# EAGLE design stoneAssistant_pwrMgmt (EAGLE 9.0.0)
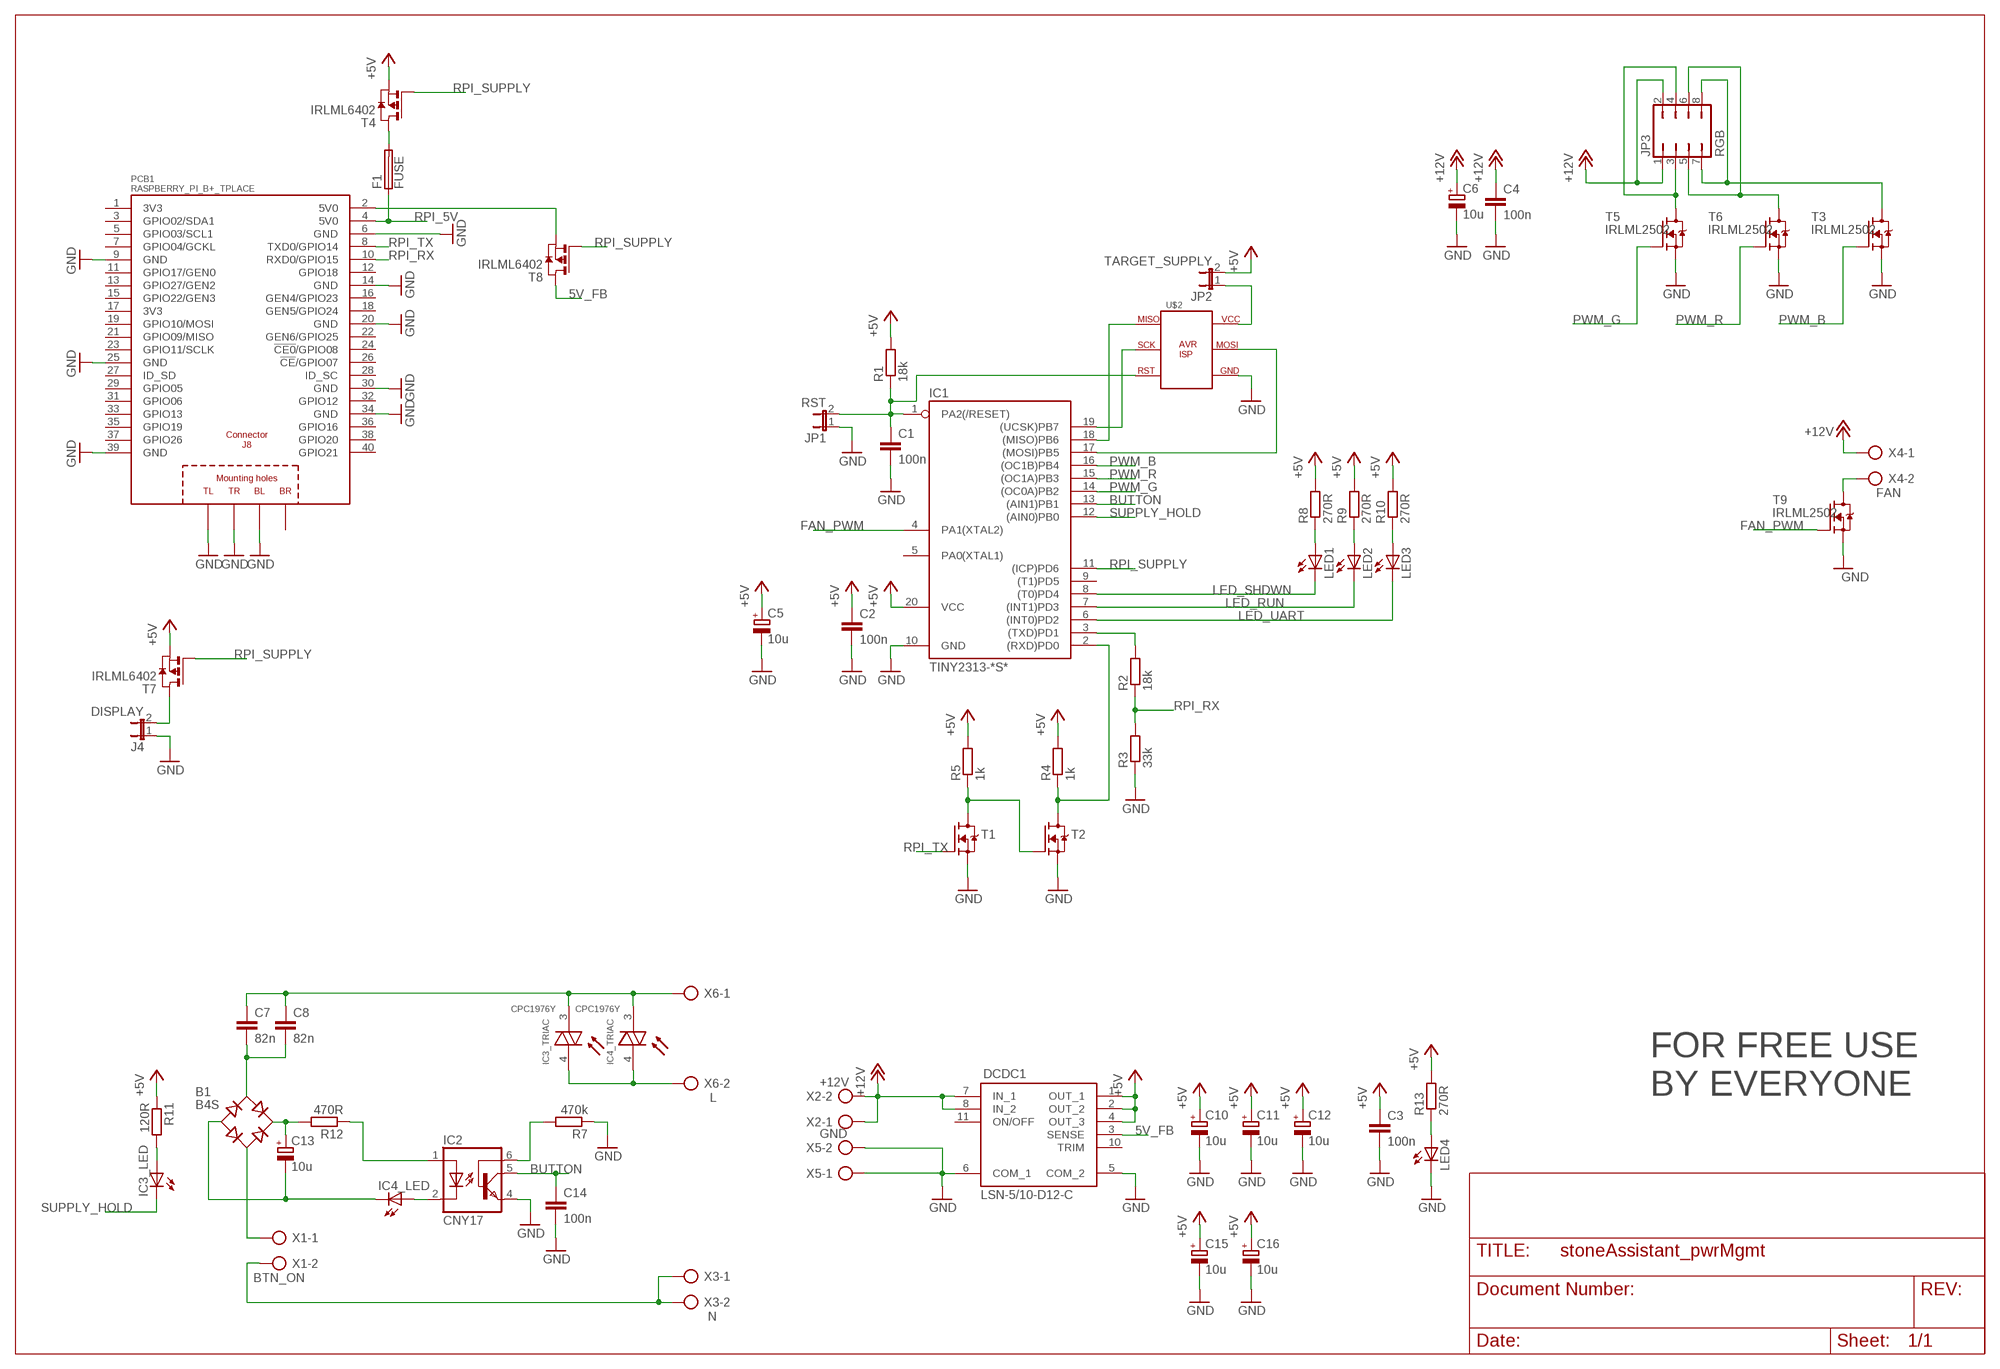
[diagram p0: schematic, sheet 1]

## Parts
B1  B4S  [MBS]
C1  100n  C-EUC0805  [C0805]
C2  100n  C-EUC0805  [C0805]
C3  100n  C-EUC0805  [C0805]
C4  100n  C-EUC0805  [C0805]
C5  10u  CPOL-EUSMCA  [SMC_A]
C6  10u  CPOL-EUSMCA  [SMC_A]
C7  82n  C-EU050-075X075  [C050-075X075]
C8  82n  C-EU050-075X075  [C050-075X075]
C10  10u  CPOL-EUSMCA  [SMC_A]
C11  10u  CPOL-EUSMCA  [SMC_A]
C12  10u  CPOL-EUSMCA  [SMC_A]
C13  10u  CPOL-EUSMCA  [SMC_A]
C14  100n  C-EUC0805  [C0805]
C15  10u  CPOL-EUSMCA  [SMC_A]
C16  10u  CPOL-EUSMCA  [SMC_A]
DCDC1  LSN-5/10-D12-C  [MURATA_LSN-5/10-D12-C]
F1  FUSE  MF-SMDF200  [MF-SMDF050]
IC1  TINY2313-*S*  [SO20L$]
IC2  CNY17  [DIL06]
IC3  CPC1976Y  [SIP8/4]
IC4  CPC1976Y  [SIP8/4]
J4  DISPLAY  JP1E  [JP1]
JP1  RST  JP1E  [JP1]
JP2  TARGET_SUPPLY  JP1E  [JP1]
JP3  RGB  JP4Q  [JP4Q]
LED1  LEDCHIPLED_0805  [CHIPLED_0805]
LED2  LEDCHIPLED_0805  [CHIPLED_0805]
LED3  LEDCHIPLED_0805  [CHIPLED_0805]
LED4  LEDCHIPLED_0805  [CHIPLED_0805]
PCB1  RASPBERRY_PI_B+_TPLACE  [RASPBERRY_PI_BPLUS_TPLACE]
R1  18k  R-EU_M0805  [M0805]
R2  18k  R-EU_M0805  [M0805]
R3  33k  R-EU_M0805  [M0805]
R4  1k  R-EU_M0805  [M0805]
R5  1k  R-EU_M0805  [M0805]
R7  470k  R-EU_M0805  [M0805]
R8  270R  R-EU_M0805  [M0805]
R9  270R  R-EU_M0805  [M0805]
R10  270R  R-EU_M0805  [M0805]
R11  120R  R-EU_M0805  [M0805]
R12  470R  R-EU_M0805  [M0805]
R13  270R  R-EU_M0805  [M0805]
T1  MOSFET-N-SOT23  [SOT23]
T2  MOSFET-N-SOT23  [SOT23]
T3  IRLML2502  [SOT-23]
T4  IRLML6402  [SOT-23]
T5  IRLML2502  [SOT-23]
T6  IRLML2502  [SOT-23]
T7  IRLML6402  [SOT-23]
T8  IRLML6402  [SOT-23]
T9  IRLML2502  [SOT-23]
U$2  AVR_ISPSINGLESIDED_SMD  [PINHEADER_254_2X3_SMD]
X1  BTN_ON  PCB2_TERMINAL-BLOCK  [2_2.54MM]
X2  +12V  PCB2_TERMINAL-BLOCK  [2_2.54MM]
X3  N  PCB2_TERMINAL-BLOCK  [2_2.54MM]
X4  FAN  PCB2_TERMINAL-BLOCK  [2_2.54MM]
X5  GND  PCB2_TERMINAL-BLOCK  [2_2.54MM]
X6  L  PCB2_TERMINAL-BLOCK  [2_2.54MM]

## Nets
5V_FB: DCDC1.3(SENSE) T8.3(D)
+5V: C2.1 C3.1 C5.+ C10.+ C11.+ C12.+ C15.+ C16.+ DCDC1.1(OUT_1) DCDC1.2(OUT_2) DCDC1.4(OUT_3) IC1.20(VCC) JP2.2 R1.2 R4.2 R5.2 R8.2 R9.2 R10.2 R11.1 R13.2 T4.2(S) T7.2(S)
+12V: C4.1 C6.+ DCDC1.7(IN_1) DCDC1.8(IN_2) JP3.1 JP3.2 X2.1 X2.2 X4.1
BUTTON: C14.1 IC1.13((AIN1)PB1) IC2.5(COL)
FAN_PWM: IC1.4(PA1(XTAL2)) T9.1(G)
GND: C1.2 C2.2 C3.2 C4.2 C5.- C6.- C10.- C11.- C12.- C14.2 C15.- C16.- DCDC1.5(COM_2) DCDC1.6(COM_1) IC1.10(GND) IC2.4(EMI) J4.1 JP1.1 LED4.C PCB1.6(GND) PCB1.9(GND) PCB1.14(GND) PCB1.20(GND) PCB1.25(GND) PCB1.30(GND) PCB1.34(GND) PCB1.39(GND) PCB1.PE_BL(BL) PCB1.PE_TL(TL) PCB1.PE_TR(TR) R3.1 R7.1 T1.2(S) T2.2(S) T3.2(S) T5.2(S) T6.2(S) T9.2(S) U$2.P$6(GND) X5.1 X5.2
LED_RUN: IC1.7((INT1)PD3) LED2.C
LED_SHDWN: IC1.8((T0)PD4) LED1.C
LED_UART: IC1.6((INT0)PD2) LED3.C
N$1: C1.1 IC1.1(PA2(/RESET)) JP1.2 R1.1 U$2.P$3(RST)
N$2: IC1.3((TXD)PD1) R2.2
N$3: IC1.2((RXD)PD0) R4.1 T2.3(D)
N$4: R5.1 T1.3(D) T2.1(G)
N$5: IC2.2(C) IC4.2(_LED:A)
N$6: IC1.19((UCSK)PB7) U$2.P$2(SCK)
N$7: IC1.18((MISO)PB6) U$2.P$1(MISO)
N$8: IC1.17((MOSI)PB5) U$2.P$7(MOSI)
N$9: JP2.1 U$2.P$8(VCC)
N$10: IC3.4(_TRIAC:A/C2) IC4.4(_TRIAC:A/C2) X6.2
N$11: C7.1 C8.1 IC3.3(_TRIAC:A/C1) IC4.3(_TRIAC:A/C1) X6.1
N$12: X1.2 X3.1 X3.2
N$13: B1.AC1 C7.2 C8.2
N$14: B1.- C13.- IC4.1(_LED:C)
N$15: B1.+ C13.+ R12.2
N$16: B1.AC2 X1.1
N$17: IC2.1(A) R12.1
N$18: IC2.6(BAS) R7.2
N$19: F1.2 T4.3(D)
N$20: LED4.A R13.1
N$21: JP3.3 JP3.4 T5.3(D)
N$22: JP3.5 JP3.6 T6.3(D)
N$23: JP3.7 JP3.8 T3.3(D)
N$24: J4.2 T7.3(D)
N$25: T9.3(D) X4.2
N$31: IC3.2(_LED:A) R11.2
N$32: PCB1.2(5V0) T8.2(S)
N$34: LED1.A R8.1
N$35: LED2.A R9.1
N$36: LED3.A R10.1
PWM_B: IC1.16((OC1B)PB4) T3.1(G)
PWM_G: IC1.14((OC0A)PB2) T5.1(G)
PWM_R: IC1.15((OC1A)PB3) T6.1(G)
RPI_5V: F1.1 PCB1.4(5V0)
RPI_RX: PCB1.10(RXD0/GPIO15) R2.1 R3.2
RPI_SUPPLY: IC1.11((ICP)PD6) T4.1(G) T7.1(G) T8.1(G)
RPI_TX: PCB1.8(TXD0/GPIO14) T1.1(G)
SUPPLY_HOLD: IC1.12((AIN0)PB0) IC3.1(_LED:C)
Unconnected: DCDC1.10(TRIM) DCDC1.11(ON/OFF) IC1.5(PA0(XTAL1)) IC1.9((T1)PD5) PCB1.3(GPIO02/SDA1) PCB1.5(GPIO03/SCL1) PCB1.7(GPIO04/GCKL) PCB1.11(GPIO17/GEN0) PCB1.12(GPIO18) PCB1.13(GPIO27/GEN2) PCB1.15(GPIO22/GEN3) PCB1.16(GEN4/GPIO23) PCB1.18(GEN5/GPIO24) PCB1.19(GPIO10/MOSI) PCB1.21(GPIO09/MISO) PCB1.22(GEN6/GPIO25) PCB1.23(GPIO11/SCLK) PCB1.24(!CE0!/GPIO08) PCB1.26(!CE!/GPIO07) PCB1.27(ID_SD) PCB1.28(ID_SC) PCB1.29(GPIO05) PCB1.31(GPIO06) PCB1.32(GPIO12) PCB1.33(GPIO13) PCB1.35(GPIO19) PCB1.36(GPIO16) PCB1.37(GPIO26) PCB1.38(GPIO20) PCB1.40(GPIO21) PCB1.PE_BR(BR)

## Notes on the sheet
- FOR FREE USE
  BY EVERYONE

## Power pins joined to a net without a drawn wire
3V3: PCB1.1(3V3) PCB1.17(3V3)

## Library data of the parts
B1 = rectifier:B*S: Surface Mount Glass Passivated Bridge Rectifiers Source: Comchip Bridge Rectifiers B05S-G_B10S-G.pdf
C1-C4 C7 C8 C14 = rcl:C-EU: CAPACITOR, European symbol
C5 C6 C10-C13 C15 C16 = rcl:CPOL-EU: POLARIZED CAPACITOR, European symbol
DCDC1 = DCDC:LSN-5/10-D12-C
F1 = fuse:MF-SMDF: MF-SMDF Series - PRC Resettable Fuses Source: http://www.farnell.com/datasheets/716597.pdf
IC1 = avr-7:TINY2313*: Atmel Tiny2313 2K Flash, 128 bytes EEPROM, 128 bytes RAM
IC2 = optocoupler:CNY17: SIEMENS OPTO COUPLER; MPN: CNY17-1; OC_FARNELL: 1045399; OC_NEWARK: 05M4044
IC3 IC4 = optotriac:CPC1976Y
J4 JP1 JP2 = jumper:JP1E: JUMPER
JP3 = jumper:JP4Q: JUMPER
LED1-LED4 = led:LED: LED OSRAM: - CHIPLED LG R971, LG N971, LY N971, LG Q971, LY Q971, LO R971, LY R971 LH N974, LH R974 LS Q976, LO Q976, LY Q976 LO Q996 - Hyper CHIPLED LW Q18S LB Q993, LB Q99A, LB R99A - SideLED LS A670, LO A670, LY A670, LG A670, LP A670 LB A673, LV A673, LT A673, LW A673 LH A674 LY A675 LS A676, LA A676, LO A676, LY A676, LW A676 LS A679, LY A679, LG A679 - Hyper Micro SIDELED® LS Y876, LA Y876, LO Y876, LY Y876 LT Y87S - SmartLED LW L88C, LW L88S LB L89C, LB L89S, LG L890 LS L89K, LO L89K, LY L89K LS L896, LA L896, LO L896, LY L896 - TOPLED LS T670, LO T670, LY T670, LG T670, LP T670 LSG T670, LSP T670, LSY T670, LOP T670, LYG T670 LG T671, LOG T671, LSG T671 LB T673, LV T673, LT T673, LW T673 LH T674 LS T676, LA T676, LO T676, LY T676, LB T676, LH T676, LSB T676, LW T676 LB T67C, LV T67C, LT T67C, LS T67K, LO T67K, LY T67K, LW E67C LS E67B, LA E67B, LO E67B, LY E67B, LB E67C, LV E67C, LT E67C LW T67C LS T679, LY T679, LG T679 LS T770, LO T770, LY T770, LG T770, LP T770 LB T773, LV T773, LT T773, LW T773 LH T774 LS E675, LA E675, LY E675, LS T675 LS T776, LA T776, LO T776, LY T776, LB T776 LHGB T686 LT T68C, LB T68C - Hyper Mini TOPLED® LB M676 - Mini TOPLED Santana® LG M470 LS M47K, LO M47K, LY M47K Source: http://www.osram.convergy.de LUXEON: - LUMILED® LXK2-PW12-R00, LXK2-PW12-S00, LXK2-PW14-U00, LXK2-PW14-V00 LXK2-PM12-R00, LXK2-PM12-S00, LXK2-PM14-U00 LXK2-PE12-Q00, LXK2-PE12-R00, LXK2-PE12-S00, LXK2-PE14-T00, LXK2-PE14-U00 LXK2-PB12-K00, LXK2-PB12-L00, LXK2-PB12-M00, LXK2-PB14-N00, LXK2-PB14-P00, LXK2-PB14-Q00 LXK2-PR12-L00, LXK2-PR12-M00, LXK2-PR14-Q00, LXK2-PR14-R00 LXK2-PD12-Q00, LXK2-PD12-R00, LXK2-PD12-S00 LXK2-PH12-R00, LXK2-PH12-S00 LXK2-PL12-P00, LXK2-PL12-Q00, LXK2-PL12-R00 Source: www.luxeon.com KINGBRIGHT: KA-3528ASYC Source: www.kingbright.com
PCB1 = RASPBERRY_PI_Bplus:RASPBERRY_PI_B+: Raspberry Pi B+ Basedon issue: Thursday, July 10, 2014 - Rev 1.2 LBR by Tim Rettmann 07-2014
R1-R5 R7-R13 = rcl:R-EU_: RESISTOR, European symbol
T1 T2 = we-transistor:MOSFET-N: N-Channel MOSFET SOT23 N-Chn MOSFET TSM3404, IRLML2502 (Vgs>=+/-20V, Vds<=20V, Id>=3A + Rds<=0.05Ohm @ Vgs=4.5V) BSS138 (Vgs>=+/-20V, Vds<=40V, Id>=0.2A + Rds<=3Ohm @ Vgs=4.5V) SOT223 Low Side Switch with Protection (Infineon) BSP76 (Vin=0...10V, Vds<=42V, Id=1.4A + Rds=0.2Ohm @ Vin=5V) BSP77 (Vin=0...10V, Vds<=42V, Id=2.2A + Rds=0.1Ohm @ Vin=5V) D²Pak Low Side Switch with Protection (Infineon) BTS117TC (Vin=0...10V, Vds<=60V, Id=3.5A + Rds=0.12Ohm @ Vin=5V) BTS133TC (Vin=0...10V, Vds<=60V, Id=7A + Rds=0.06Ohm @ Vin=5V) BTS141TC (Vin=0...10V, Vds<=60V, Id=12A + Rds=0.03Ohm @ Vin=5V) BTS3018TC (Vin=0...10V, Vds<=60V, Id=6A + Rds=0.02Ohm @ Vin=5V)
T3 T5 T6 T9 = nxs_transistor:IRLML2502: N-Channel MOSFET, Ultra Low On-Resistance, Logic Level www.irf.com
T4 T7 T8 = IRLML6402:IRLML6402
U$2 = stoneTronics:AVR_ISP
X1-X6 = nxs_con-misc:PCB2_TERMINAL-BLOCK: 2 way PCB terminal block 2.54mm RS Best.-Nr.: 790-1098

## Board
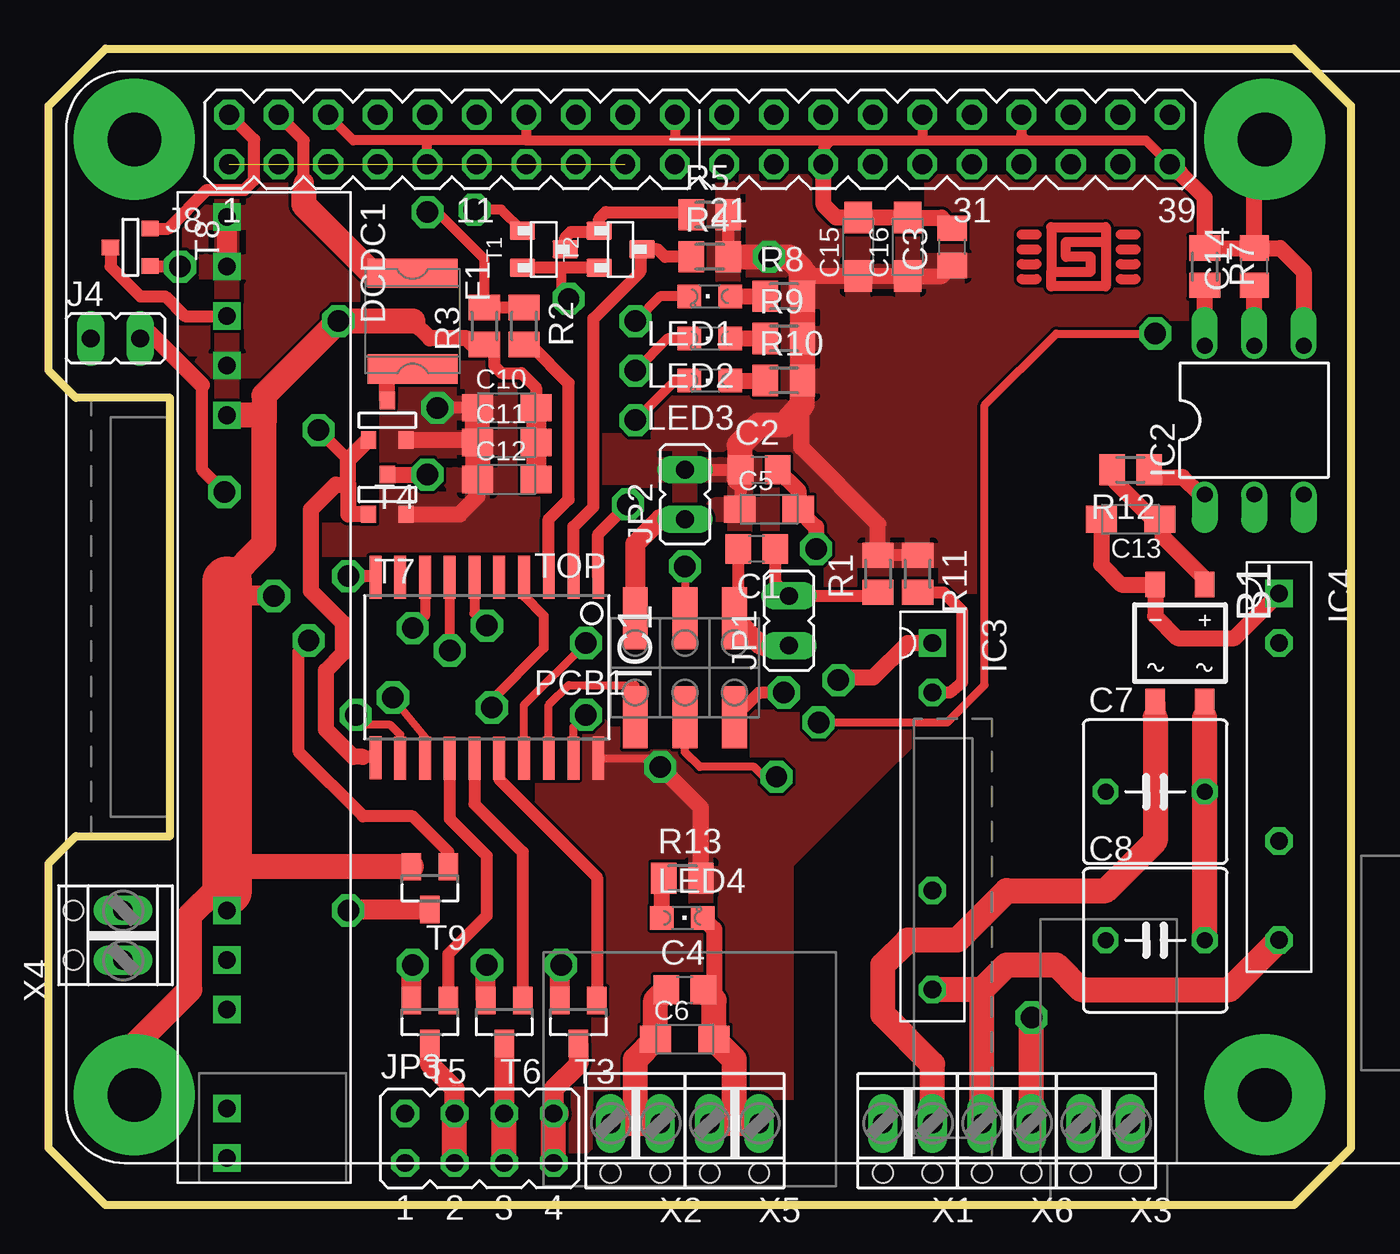
[diagram p1: board, top side]
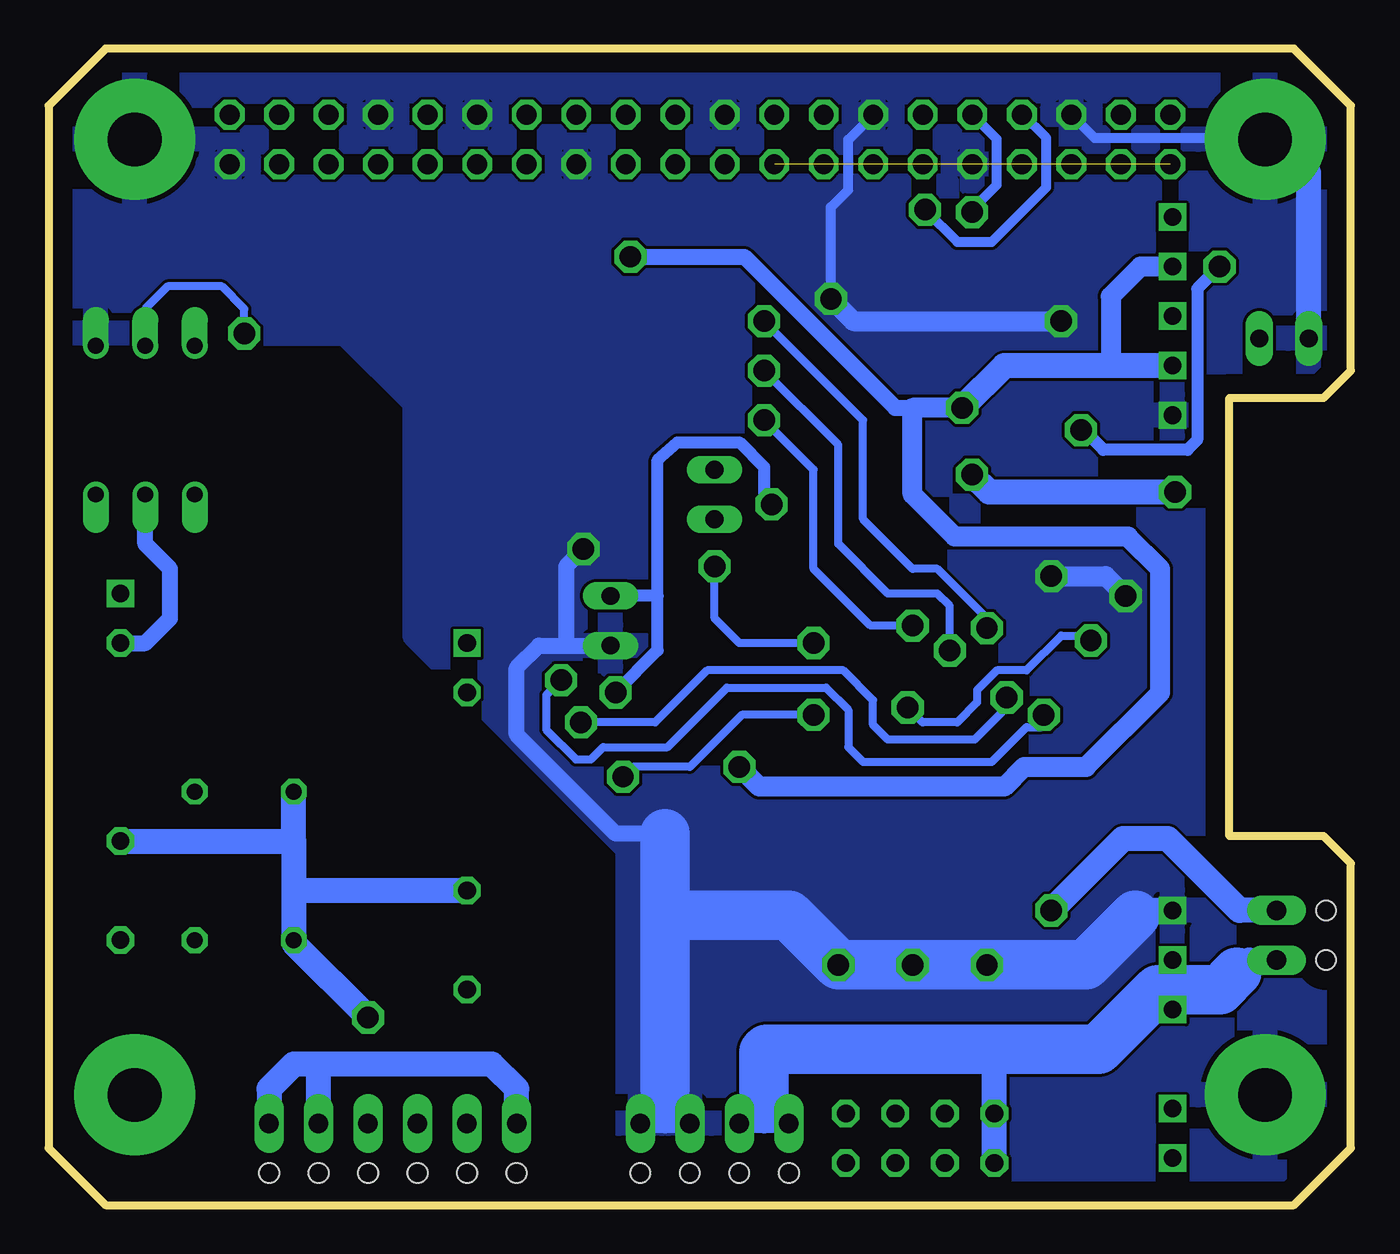
[diagram p2: board, bottom side, seen from below]

Size 66.8 x 59.31 mm. Coordinates in mm from the lower left corner, seen from the top.
Outline: 2.92,0 0,2.92 0,17.53 1.4,18.92 6.22,18.92 6.22,41.4 1.4,41.4 0,42.8 0,56.39 2.92,59.31 63.88,59.31 66.8,56.39 66.8,2.92 63.88,0 2.92,0
Copper layers (1*16): Top 0.035mm / dielectric 1.5mm / Bottom 0.035mm
Design rules "default": minimum track width 6mil, minimum drill 0.35mm, track to track 6mil, track to pad 6mil, pad to pad 6mil, via to via 6mil, smd to smd 6mil, copper to edge 40mil, drill to drill 6mil, minimum pad ring 10mil, minimum via ring 8mil, stop-mask expansion 4mil, vias tented up to drill 0mil, thermal gap 10mil

### Footprints (pad centres in the part's own frame; a part is rotated, then mirrored left to right if it is on the bottom)
MBS = smd 1 x 1.3: + -1.27,-3; - 1.27,-3; AC1 -1.27,3; AC2 1.27,3
C0805 = smd 1.3 x 1.5: 1 -0.95,0; 2 0.95,0
SMC_A = smd 1.6 x 1.4: + -1.5,0; - 1.5,0
C050-075X075 = drill 0.813 octagon: 1 -2.54,0; 2 2.54,0
MURATA_LSN-5/10-D12-C = drill 0.9 square: 1 -25.4,-1.27; 2 -22.86,-1.27; 3 -20.32,-1.27; 4 -17.78,-1.27; 5 -15.24,-1.27; 6 10.16,-1.27; 7 12.7,-1.27; 8 15.24,-1.27; 10 20.32,-1.27; 11 22.86,-1.27
MF-SMDF050 = smd 1.5 x 4.6: 1 -2.45,0; 2 2.45,0
SO20L$ = smd 0.61 x 2.21: 1 -5.715,-4.636; 2 -4.445,-4.636; 3 -3.175,-4.636; 4 -1.905,-4.636; 5 -0.635,-4.636; 6 0.635,-4.636; 7 1.905,-4.636; 8 3.175,-4.636; 9 4.445,-4.636; 10 5.715,-4.636; 11 5.715,4.61; 12 4.445,4.636; 13 3.175,4.636; 14 1.905,4.636; 15 0.635,4.636; 16 -0.635,4.636; 17 -1.905,4.636; 18 -3.175,4.636; 19 -4.445,4.636; 20 -5.715,4.636
DIL06 = drill 0.813 offset: 1 -2.54,-3.81; 2 0,-3.81; 3 2.54,-3.81; 4 2.54,3.81; 5 0,3.81; 6 -2.54,3.81
SIP8/4 = drill 0.9 square: 1 -8.89,0 | drill 0.9 octagon: 2 -6.35,0; 3 3.81,0; 4 8.89,0
JP1 = drill 0.914 long: 1 0,-1.27; 2 0,1.27
JP4Q = drill 0.914 octagon: 1 -3.81,-1.27; 2 -3.81,1.27; 3 -1.27,-1.27; 4 -1.27,1.27; 5 1.27,-1.27; 6 1.27,1.27; 7 3.81,-1.27; 8 3.81,1.27
CHIPLED_0805 = smd 1.2 x 1.2: A 0,-1.05; C 0,1.05
RASPBERRY_PI_BPLUS_TPLACE = drill 1.016 octagon: 1 8.37,51.23; 2 8.37,53.77; 3 10.91,51.23; 4 10.91,53.77; 5 13.45,51.23; 6 13.45,53.77; 7 15.99,51.23; 8 15.99,53.77; 9 18.53,51.23; 10 18.53,53.77; 11 21.07,51.23; 12 21.07,53.77; 13 23.61,51.23; 14 23.61,53.77; 15 26.15,51.23; 16 26.15,53.77; 17 28.69,51.23; 18 28.69,53.77; 19 31.23,51.23; 20 31.23,53.77; 21 33.77,51.23; 22 33.77,53.77; 23 36.31,51.23; 24 36.31,53.77; 25 38.85,51.23; 26 38.85,53.77; 27 41.39,51.23; 28 41.39,53.77; 29 43.93,51.23; 30 43.93,53.77; 31 46.47,51.23; 32 46.47,53.77; 33 49.01,51.23; 34 49.01,53.77; 35 51.55,51.23; 36 51.55,53.77; 37 54.09,51.23; 38 54.09,53.77; 39 56.63,51.23; 40 56.63,53.77 | drill 2.75 pad 6.2: PE_BL 3.5,3.5; PE_BR 61.5,3.5; PE_TL 3.5,52.5; PE_TR 61.5,52.5
M0805 = smd 1.3 x 1.6: 1 -0.95,0; 2 0.95,0
SOT23 = smd 1.3 x 0.9: 1 -1.1,0.95; 2 -1.1,-0.95; 3 1.1,0
SOT-23 = smd 1 x 1.4: 1 -0.95,-1.1; 2 0.95,-1.1; 3 0,1.1
SOT-23' = smd 0.787 x 0.889: 1 0.991,1.016; 2 -0.94,1.016; 3 0.025,-1.016
PINHEADER_254_2X3_SMD = smd 1.27 x 3.175: P$1 -3.81,-1.27; P$2 -1.27,-1.27; P$3 1.27,-1.27; P$6 1.27,3.81; P$7 -1.27,3.81; P$8 -3.81,3.81
2_2.54MM = drill 1 long: 1 -1.27,0; 2 1.27,0 | hole 1.016: 1.27,2.54; -1.27,2.54

### Placement (x,y rotation side)
B1  58.04,28.83 180 top
C1  36.32,33.66 180 top
C2  36.45,37.72 0 top
C3  46.36,49.15 90 top
C4  32.64,11.05 0 top
C5  36.96,35.69 0 top
C6  32.64,8.51 0 top
C7  56.77,21.21 0 top
C8  56.77,13.59 0 top
C10  23.5,40.89 0 top
C11  23.5,39.12 0 top
C12  23.5,37.21 0 top
C13  55.5,35.18 180 top
C14  61.85,48.13 90 top
C15  41.53,49.15 90 top
C16  44.07,49.15 90 top
DCDC1  10.41,25.27 270 top
F1  18.67,45.34 270 top
IC1  22.48,27.56 180 top
IC2  61.85,40.26 0 top
IC3  45.34,19.94 270 top
IC4  63.12,22.48 270 top
J4  3.43,44.45 270 top
JP1  37.97,29.97 0 top
JP2  32.64,36.45 0 top
JP3  22.1,3.43 0 top
LED1  33.91,46.61 90 top
LED2  33.91,44.45 90 top
LED3  33.91,42.29 90 top
LED4  32.51,14.73 270 top
PCB1  0.89,2.16 0 top
R1  42.55,32.38 90 top
R2  24.38,45.09 270 top
R3  22.35,45.09 90 top
R4  33.91,48.64 0 top
R5  33.91,50.8 0 top
R7  59.31,48.13 270 top
R8  37.72,46.61 0 top
R9  37.72,44.45 0 top
R10  37.72,42.29 0 top
R11  44.58,32.38 270 top
R12  55.5,37.72 180 top
R13  32.51,16.76 0 top
T1  25.4,49.02 0 top
T2  29.34,49.02 0 top
T3  27.18,9.4 180 top
T4  IRLML6402  [SOT-23']  17.4,40.26 180 top
T5  19.56,9.4 180 top
T6  23.37,9.4 180 top
T7  IRLML6402  [SOT-23']  17.4,36.45 180 top
T8  IRLML6402  [SOT-23']  4.19,49.15 270 top
T9  19.56,16.26 180 top
U$2  33.91,26.29 0 top
X1  44.07,4.19 180 top
X2  30.1,4.19 180 top
X3  54.23,4.19 180 top
X4  3.81,13.84 90 top
X5  35.18,4.19 180 top
X6  49.15,4.19 180 top

### Tracks (layer width: path | path; a pad name or v marks a point on that pad's centre or on a via)
3V3  (1 unrouted)
5V_FB
  Top 0.61: T8.3 3.17,48.13 4.7,46.61 5.97,46.61 6.99,45.59 DCDC1.3
+5V  (via drill 1.1)
  Top 0.406: IC1.20 30.92,22.92 v31.37,22.48
  Top 0.61: C10.+ v19.94,40.89 | JP2.2 C2.1 35.5,37.21 35.5,35.73 C5.+ | R11.1 R1.2 | R5.2 R4.2
  Top 0.813: T4.2 21.23,39.24 C11.+ | R1.2 42.55,34.92 38.61,38.86 38.61,41.02 38.67,41.08 | 36.45,48.64 v36.96,48.64 | 38.61,48.01 38.73,47.88 38.99,47.88 39.22,47.65 C15.+ C16.+ 45.8,47.65 C3.1 | T7.2 21.08,35.43 22,36.35 C12.+ | R13.2 33.46,20.39 v31.37,22.48
  Top 1.016: DCDC1.2 DCDC1.1
  Top 1.27: C10.+ C11.+ C12.+ | v36.96,48.64 37.97,48.64 38.61,48.01 38.61,46.67 R8.2 R9.2 R10.2 38.67,41.08 37.72,40 36.45,40 35.43,38.99 35.43,37.28 35.5,37.21 | R4.2 36.45,48.64
  Bottom 0.813: v36.96,48.64 31.11,48.64 23.37,40.89 22.48,40.89
  Bottom 1.016: v31.37,22.48 30.35,21.46 17.78,21.46 16.76,22.48 13.59,22.48 9.78,26.29 9.78,32.64 11.43,34.29 20.32,34.29 22.48,36.45 22.48,40.89 v19.94,40.89 | DCDC1.2 10.79,48.13 12.32,46.61 12.32,43.05
  Bottom 1.27: v19.94,40.89 17.78,43.05 12.32,43.05 DCDC1.4
  pour Top: 0,3.05 3.05,0 37.59,0 37.59,17.65 48.64,28.7 48.64,40.77 52.2,44.32 66.67,44.32 66.67,56.26 63.63,59.31 2.67,59.18 -0.13,56.39 0,42.67 1.4,41.27 6.35,41.27 6.35,18.92 1.4,18.92 0,17.4
+12V
  Top 1.27: X2.2 30.1,4.19 | 30.1,4.19 X2.1 | 30.1,4.19 30.1,7.47 C6.+ 31.14,10.5 C4.1
  Bottom 1.016: X2.2 30.1,4.19 | 30.1,4.19 X2.1 | 30.1,4.7 30.1,4.19
  Bottom 1.27: DCDC1.8 9.14,11.05 | DCDC1.7 9.14,11.05 | 9.14,11.05 9.91,11.05 | JP3.1 JP3.2 18.29,8 | 30.1,5.84 30.1,4.7 | 30.1,8.51 30.1,7.87 | 5.84,11.94 5.21,12.57 X4.1
  Bottom 2.54: 9.91,11.05 12.95,8 18.29,8 29.97,8 30.1,7.87 30.1,5.84 | 9.14,11.05 6.73,11.05 5.84,11.94
BUTTON  (via drill 1.1)
  Top 0.406: IC1.13 19.3,24 v17.65,26.04 | v56.77,44.7 51.69,44.7 48.01,41.02 48.01,26.67 46.1,24.77 v39.5,24.77
  Top 0.813: IC2.5 C14.1
  Bottom 0.406: v17.65,26.04 17.91,25.78 17.91,25.27 19.3,23.88 23.75,23.88 24.51,24.64 24.51,25.91 26.04,27.43 33.02,27.43 35.69,24.77 v39.5,24.77 | v56.77,44.7 56.77,45.97 57.91,47.12 60.71,47.12 61.85,45.97 IC2.5
FAN_PWM  (via drill 1.1)
  Top 0.508: IC1.4 24.38,31.24 25.4,30.23 25.4,28.57 22.73,25.91 v22.73,25.53
  Top 0.61: v13.33,28.96 12.83,28.45 12.83,23.24 16.13,19.94 18.67,19.94 20.51,18.1 T9.1
  Bottom 0.406: v22.73,25.53 21.97,24.77 20.19,24.77 19.18,25.78 19.18,26.42 18.16,27.43 16.64,27.43 14.86,29.21 13.59,29.21
  Bottom 0.508: 13.59,29.21 v13.33,28.96
GND  (via drill 1.1)
  Top 0.508: PCB1.6 14.34,55.89 15.62,54.61 19.3,54.61 | PCB1.9 19.42,54.49 19.3,54.61 | 44.96,54.61 50.17,54.61 | 40.13,54.61 44.96,54.61 | 32.13,54.61 40.13,54.61 | 24.5,54.61 32.13,54.61 | 24.5,54.61 19.3,54.61 | 50.17,54.61 56.3,54.61 PCB1.39 | PCB1.34 49.9,54.88 50.17,54.61 | PCB1.30 44.82,54.75 44.96,54.61 | PCB1.25 39.74,54.22 40.13,54.61 | PCB1.20 32.12,54.62 32.13,54.61 | PCB1.14 24.5,54.61 | 26.29,48.07 26.29,46.48 v26.67,46.48 | R3.1 21.9,44.13
  Top 0.61: R3.1 22.86,43.63 22.86,43.05 23.24,42.67 24.26,42.67 25,41.93 C10.- | C1.2 35.37,30.29 U$2.P$6 | T2.2 26.29,48.07 T1.2 | IC1.10 16.76,32.26 v15.37,32.26
  Top 0.813: 8.89,14.86 DCDC1.6 | C14.2 R7.1 59.31,51.69 58.04,52.96 57.95,52.96 PCB1.39 | C14.2 61.85,54.12 PCB1.PE_TR | C14.2 63.19,49.08 64.39,47.88 IC2.4 | C2.2 38.46,36.66 C5.- 39.37,34.77 v39.37,33.66 | PCB1.25 39.75,53.38 39.75,51.31 40.41,50.65 C15.- C16.- 45.8,50.65 C3.2 | R3.1 21.78,44.13 21.46,44.45 19.56,44.45 18.67,45.34 | LED4.C 34.14,14.16 34.14,10.5
  Top 1.016: C10.- C11.- C12.- | U$2.P$6 36.58,28.7 JP1.1 | v11.56,31.24 9.91,31.24 9.14,32 | T5.2 18.61,12.26 v18.67,12.32 | T6.2 22.42,12.26 v22.48,12.32 | T3.2 26.23,12.26 v26.29,12.32
  Top 1.27: DCDC1.6 9.14,16.13 8.51,16.13 7.24,14.86 7.24,11.05 4.39,8.2 PCB1.PE_BL | DCDC1.5 10.67,40.51 11.05,40.13 | 9.14,32 11.05,33.91 11.05,40.13 | 18.67,45.34 v14.86,45.34 11.05,41.53 11.05,40.13 | T9.2 9.19,17.36 9.14,17.4 | X5.2 35.18,4.19 | 35.18,4.19 X5.1 | 35.18,4.19 35.18,7.47 C6.- 34.14,10.5 C4.2
  Top 2.54: 9.14,16.13 9.14,17.4 9.14,32
  Bottom 0.406: 13.08,54.67 13.15,54.74
  Bottom 0.508: PCB1.6 13.15,54.74 4.47,54.74 PCB1.PE_TL | v26.67,46.48 26.67,51.18 25.78,52.07 25.78,54.65 PCB1.14
  Bottom 0.61: v15.37,32.26 15.37,32.13
  Bottom 0.813: 40.26,28.7 JP1.1 | 35.18,19.05 37.72,19.05 42.8,24.13 42.8,27.56 41.66,28.7 40.26,28.7 | v39.37,33.66 40.26,32.77 40.26,28.7
  Bottom 1.016: v26.67,46.48 25.53,45.34 v14.86,45.34 | v15.37,32.26 12.57,32.26 v11.56,31.24 | X5.2 35.18,4.19 | 35.18,4.19 X5.1 | 35.18,5.97 35.18,4.19
  Bottom 1.27: 35.18,5.97 35.18,4.7 | 11.05,14.86 10.79,15.11 DCDC1.6 | 4.47,54.74 3.94,54.74 2.16,52.96 J4.1
  Bottom 2.54: 35.18,19.05 35.18,14.86 | 35.18,14.86 35.18,5.97 | 35.18,14.86 28.83,14.86 v26.29,12.32 v22.48,12.32 v18.67,12.32 13.59,12.32 11.05,14.86
  pour Bottom: 0,2.92 2.92,0 37.08,0 37.08,18.29 48.01,29.21 48.01,41.15 51.56,44.7 66.67,44.7 66.67,56.26 63.63,59.31 2.67,59.18 -0.13,56.39 0,42.8 1.4,41.4 6.22,41.4 6.35,41.27 6.35,18.92 6.22,18.8 1.4,18.8 0,17.27
LED_RUN  (via drill 1.1)
  Top 0.508: LED2.C 31.75,44.45 v30.1,42.8 | IC1.7 v20.57,28.45
  Bottom 0.406: v20.57,28.45 20.57,30.73 21.21,31.37 23.75,31.37 26.29,33.91 26.29,38.99 v30.1,42.8
LED_SHDWN  (via drill 1.1)
  Top 0.508: LED1.C 31.37,46.61 v30.1,45.34 | IC1.8 19.3,30.23 v18.67,29.59
  Bottom 0.406: v18.67,29.59 18.67,30.1 21.21,32.64 22.48,32.64 25.02,35.18 25.02,40.26 v30.1,45.34
LED_UART  (via drill 1.1)
  Top 0.508: LED3.C 32.13,42.29 v30.1,40.26 | IC1.6 21.84,30.35 v22.48,29.72
  Bottom 0.406: v22.48,29.72 24.64,29.72 27.56,32.64 27.56,37.72 v30.1,40.26
N$1  (via drill 1.1)
  Top 0.61: IC1.1 28.19,34.42 v29.72,35.94 | C1.1 37.27,31.94 JP1.2 42.1,31.24 R1.1 | v37.72,26.29 36.45,26.29 U$2.P$3
  Bottom 0.61: v37.72,26.29 35.56,28.45 35.56,31.24 | 35.56,31.24 JP1.2 | v29.72,35.94 30.1,36.32 30.1,37.85 31.37,39.12 34.54,39.12 35.56,38.23 35.56,31.24
N$2
  Top 0.61: IC1.3 25.65,35.18 26.67,36.2 26.67,42.16 24.77,44.07 24.45,44.07 R2.2
N$3
  Top 0.61: IC1.2 26.92,34.8 27.94,35.81 27.94,45.47 30.35,47.88 30.35,48.94 | 30.35,48.94 T2.3 | R4.1 31.62,48.64 31.24,49.02 T2.3 | T2.3 30.35,48.94
N$4
  Top 0.61: T1.3 26.5,49.61 26.8,49.91 28.18,49.91 T2.1 28.24,50.59 28.57,50.93 32.83,50.93 R5.1
N$5
  Bottom 0.813: IC4.2 61.85,28.83 60.58,30.1 60.58,32.64 61.85,33.91 IC2.2
N$6  (via drill 1.1)
  Top 0.406: v37.34,21.97 36.7,21.97 36.2,22.48 33.4,22.48 32.64,23.24 U$2.P$2 | IC1.19 26.92,24.51 v27.56,25.15
  Bottom 0.406: v27.56,25.15 31.24,25.15 33.91,22.48 36.83,22.48 v37.34,21.97
N$7
  Top 0.406: IC1.18 25.65,25.65 26.67,26.67 30.1,26.67 U$2.P$1
N$8  (via drill 1.1)
  Top 0.406: IC1.17 24.38,25.65 v27.56,28.83 | v32.64,32.77 U$2.P$7
  Bottom 0.406: v27.56,28.83 31.37,28.83 U$2.P$7 v32.64,32.77
N$9
  Top 1.016: U$2.P$8 30.1,33.91 31.37,35.18 JP2.1
N$10
  Top 1.27: 47.88,11.05 IC3.4 | IC4.4 60.58,11.05 52.96,11.05 51.69,12.32 49.15,12.32 47.88,11.05 | X6.2 47.88,11.05
N$11  (via drill 1.1)
  Top 1.27: X6.1 v50.42,9.63
  Bottom 1.27: 54.23,16.13 C8.1 54.23,13.44 v50.42,9.63 | 54.23,18.67 54.23,16.13 | 54.23,18.67 C7.1 | IC3.3 54.23,16.13 | IC4.3 54.23,18.67
N$12
  Bottom 1.27: X1.2 42.8,5.97 44.07,7.24 52.96,7.24 | 52.96,7.24 54.23,7.24 55.5,5.97 X3.1 | X3.2 52.96,7.24
N$13
  Top 1.016: 59.31,25.02 B1.AC1
  Top 1.27: C8.2 C7.2 59.31,25.02
N$14
  Top 0.813: C13.- 54,32.87 55.04,31.83 B1.- 56.77,30.23 57.91,29.08 60.83,29.08 IC4.1
N$15
  Top 0.813: 57.15,35.03 C13.+ | 57.15,35.03 57.15,34.29 59.31,32.13 B1.+ | R12.2 54.74,37.53 54.74,37.08 56.79,35.03 57.15,35.03
N$16
  Top 1.016: B1.AC2 56.77,25.02
  Top 1.27: 56.77,25.02 56.77,18.67 54.23,16.13 49.15,16.13 46.61,13.59 44.07,13.59 42.8,12.32 42.8,9.78 45.34,7.24 X1.1
N$17
  Top 0.813: R12.1 56.83,37.34 58.17,37.34 59.05,36.45 IC2.1
N$18
  Top 0.813: IC2.6 R7.2
N$19
  Top 0.813: T4.3 17.37,42.77 17.4,42.8 18.58,42.8 F1.2
N$20
  Top 0.813: LED4.A 31.46,16.66 R13.1
N$21
  Top 1.016: JP3.4 20.83,5.97 19.56,7.24 T5.3
  Top 1.27: JP3.3 JP3.4
N$22
  Top 1.016: T6.3 JP3.6
  Top 1.27: JP3.5 JP3.6
N$23
  Top 1.016: T3.3 27.18,7.24 25.91,5.97 JP3.8
  Top 1.27: JP3.7 JP3.8 26.05,4.7
N$24  (via drill 1.1)
  Top 0.61: 7.85,42.07 7.85,37.74 v9.02,36.58
  Top 0.813: T7.3 v19.43,37.46 | J4.2 5.21,44.45 5.21,44.72 7.85,42.07
  Bottom 1.27: v19.43,37.46 18.54,36.58 v9.02,36.58
N$25  (via drill 1.1)
  Top 1.016: T9.3 15.41,15.16 v15.37,15.11
  Bottom 1.27: X4.2 5.71,15.11 9.4,18.8 11.68,18.8 v15.37,15.11
N$26
  Top 0.508: 54.23,49.4 54.23,50.16 51.44,50.16 51.44,47.88 | 54.23,49.4 54.23,47.12 51.44,47.12 51.44,47.88 | 51.44,47.88 53.47,47.88 53.47,48.64 52.2,48.64 52.2,49.4 54.23,49.4
N$27
  Top 0.508: 54.99,49.78 55.75,49.78
N$28
  Top 0.508: 54.99,49.02 55.75,49.02
N$29
  Top 0.508: 54.99,48.26 55.75,48.26
N$30
  Top 0.508: 54.99,47.5 55.75,47.5
N$31
  Top 0.61: R11.2 45.91,31.43 46.86,30.48 46.86,26.8 46.23,26.29 IC3.2
N$32
  Top 0.61: T8.2 6.15,50.09 8.13,52.07 10.03,52.07 10.54,52.58 10.54,54.65 PCB1.2
N$33
  Top 0.508: 49.91,49.78 50.67,49.78
N$34
  Top 0.813: LED1.A R8.1
N$35
  Top 0.813: LED2.A R9.1
N$36
  Top 0.813: LED3.A R10.1
N$37
  Top 0.508: 49.91,49.02 50.67,49.02
N$38
  Top 0.508: 49.91,48.26 50.67,48.26
N$39
  Top 0.508: 49.91,47.5 50.67,47.5
PWM_B
  Top 0.61: IC1.16 23.11,21.84 28.13,16.83 T3.1
PWM_G
  Top 0.61: T5.1 20.51,12.89 22.48,14.86 22.48,17.91 20.57,19.81 IC1.14
PWM_R
  Top 0.61: IC1.15 21.84,20.57 24.32,18.1 T6.1
RPI_5V
  Top 0.61: 13.08,52.45 13.08,54.61 11.8,55.89 PCB1.4
  Top 1.016: 13.08,51.82 13.08,52.45
  Top 1.27: 13.08,51.82 13.08,51.31 16.6,47.79 F1.1
RPI_RX  (via drill 1.1)
  Top 0.508: R3.2 22.35,48.51 19.94,50.93 v19.43,50.93
  Top 0.61: R2.1 R3.2
  Bottom 0.508: v19.43,50.93 19.43,51.05 18.16,52.32 18.16,54.67 PCB1.10
RPI_SUPPLY  (via drill 1.1)
  Top 0.61: 16.13,22.99 16.73,22.99 IC1.11 | T8.1 6.71,48.16 v6.73,48.13 | v13.84,39.75 15.37,38.23
  Top 0.813: T7.1 15.37,35.43 15.37,36.96 | T4.1 16.38,39.24 15.37,38.23 15.37,36.96 | 16.13,22.99 15.62,22.99 14.22,24.38 14.22,27.43 15.11,28.32 15.11,29.84 13.46,31.5 13.46,35.69 14.73,36.96 15.37,36.96
  Bottom 0.61: v6.73,48.13 7.87,46.99 7.87,39.24 8.38,38.73 12.7,38.73 13.72,39.75 v13.84,39.75
RPI_TX  (via drill 1.1)
  Top 0.508: 24.3,49.99 T1.1 23.22,51.05 v21.84,51.05
  Bottom 0.508: v21.84,51.05 20.19,49.4 18.41,49.4 15.62,52.2 15.62,54.74 16.81,55.93 PCB1.8
SUPPLY_HOLD  (via drill 1.1)
  Top 0.406: IC1.12 18.03,23.75 | 18.03,23.75 18.03,24.13 | 18.03,23.75 18.03,24.13 | 18.03,24.13 17.53,24.64 16.26,24.64 v15.75,25.15
  Top 0.813: IC3.1 44.07,28.83 42.29,27.05 40.51,27.05 v40.51,26.92
  Bottom 0.406: v40.51,26.92 41.28,26.16 41.28,24.38 39.75,22.86 38.99,22.86 38.35,23.49 35.05,23.49 32,26.54 26.92,26.54 25.78,25.4 25.78,23.49 25.02,22.73 18.41,22.73 16.64,24.51 15.88,24.51 15.75,24.64 v15.75,25.15

### Text on the board
bprint: github.com/stonetronics | 14.6.2018 | for free use | by everyone | MAINS | stonetronics | stoneAssistant | VOLTAGE | pwr & pwm
tprint: T1 | T2 | R5 | F1 | R4 | T8 | R3 | LCD | C14 | R7 | C3 | LED1 | R8 | LED2 | R9 | R2 | C15 | C16 | - | LED3 | R10 | + | T4 | C10 | SUPPLY | TARGET | C11 | C2 | IC2 | R12 | T7 | C12 | C5 | C1 | C13 | R11 | R1 | B1 | ICSP | C7 | IC4 | IC1 | IC3 | RST | - | T9 | R13 | LED4 | C8 | T5 | T6 | T3 | C4 | C6 | X4 | + | X2 | X5 | X1 | X6 | X3 | JP3 | DCDC1